# EAGLE design biggity (EAGLE 9.1.1)
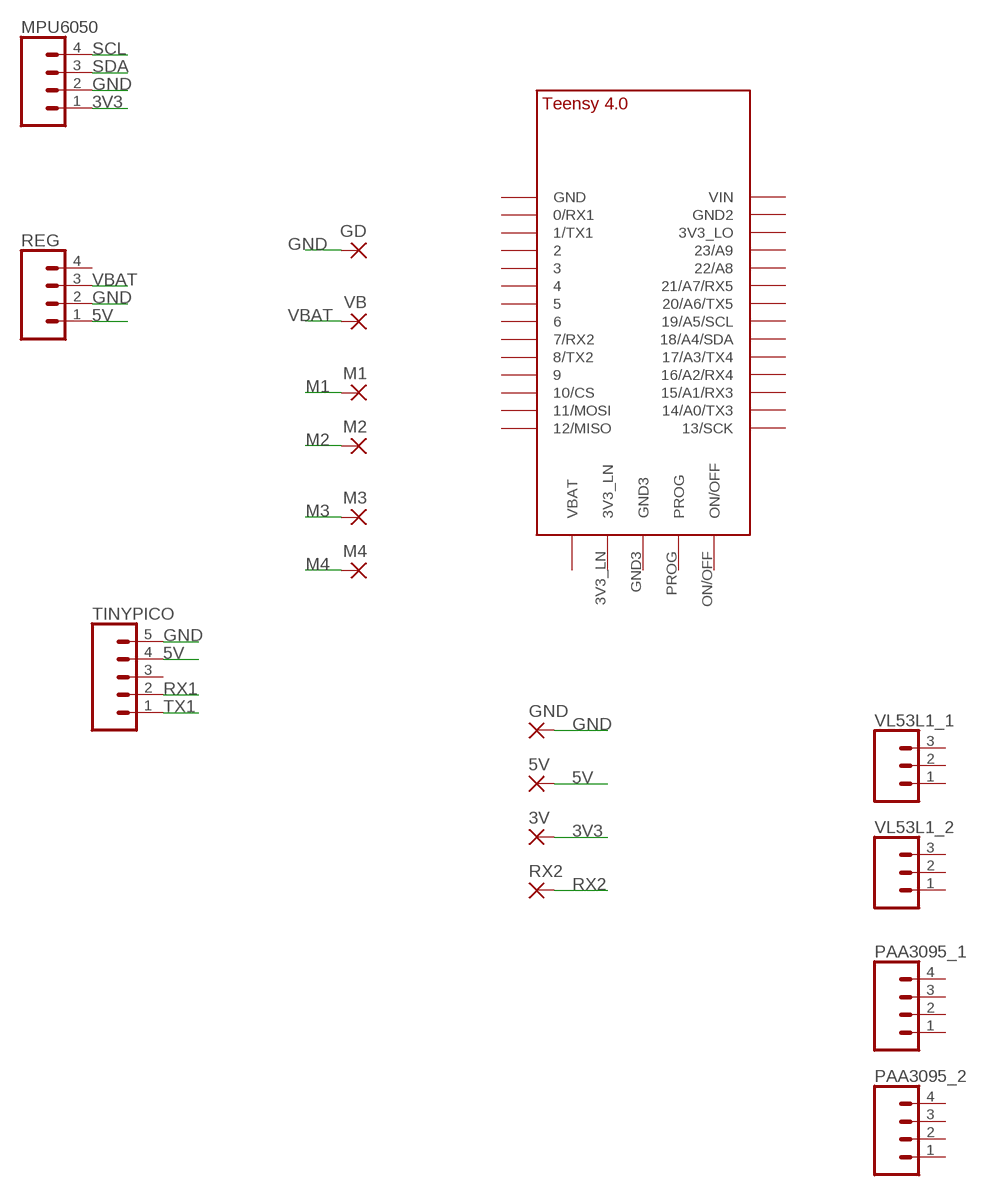
[diagram p0: schematic, sheet 1]

## Parts
3V  SMD2  [SMD1,27-2,54]
5V  SMD2  [SMD1,27-2,54]
GD  SMD2  [SMD1,27-2,54]
GND  SMD2  [SMD1,27-2,54]
M1  SMD2  [SMD1,27-2,54]
M2  SMD2  [SMD1,27-2,54]
M3  SMD2  [SMD1,27-2,54]
M4  SMD2  [SMD1,27-2,54]
MPU6050  CONN_041X04_NO_SILK  [1X04_NO_SILK]
PAA3095_1  CONN_041X04_NO_SILK  [1X04_NO_SILK]
PAA3095_2  CONN_041X04_NO_SILK  [1X04_NO_SILK]
REG  CONN_041X04_NO_SILK  [1X04_NO_SILK]
RX2  SMD2  [SMD1,27-2,54]
TINYPICO  CONN_05NO_SILK  [1X05_NO_SILK]
U$1  TEENSY_4.0  [TEENSY_4.0]
VB  SMD2  [SMD1,27-2,54]
VL53L1_1  CONN_031X03_NO_SILK  [1X03_NO_SILK]
VL53L1_2  CONN_031X03_NO_SILK  [1X03_NO_SILK]

## Nets
3V3: 3V.1(P) MPU6050.1
5V: 5V.1(P) REG.1 TINYPICO.4
GND: GD.1(P) GND.1(P) MPU6050.2 REG.2 TINYPICO.5
M1: M1.1(P)
M2: M2.1(P)
M3: M3.1(P)
M4: M4.1(P)
RX1: TINYPICO.2
RX2: RX2.1(P)
SCL: MPU6050.4
SDA: MPU6050.3
TX1: TINYPICO.1
VBAT: REG.3 VB.1(P)
Unconnected: PAA3095_1.1 PAA3095_1.2 PAA3095_1.3 PAA3095_1.4 PAA3095_2.1 PAA3095_2.2 PAA3095_2.3 PAA3095_2.4 REG.4 TINYPICO.3 U$1.0/RX(0/RX1) U$1.1/TX(1/TX1) U$1.2 U$1.3/CANTX U$1.3V3_LN U$1.3V3_LO U$1.4/CANRX U$1.5 U$1.6 U$1.7(7/RX2) U$1.8(8/TX2) U$1.9/CS U$1.10/CS U$1.11/MOSI U$1.12/MISO U$1.13/SCK U$1.14/A0(14/A0/TX3) U$1.15/A1(15/A1/RX3) U$1.16/A2(16/A2/RX4) U$1.17/A3(17/A3/TX4) U$1.18/A4/SDA U$1.19/A5/SCL U$1.20/A6(20/A6/TX5) U$1.21/A7(21/A7/RX5) U$1.22/A8 U$1.23/A9 U$1.GND U$1.GND2 U$1.GND3 U$1.ON/OFF U$1.PROG U$1.VBAT\(VBAT) U$1.VIN VL53L1_1.1 VL53L1_1.2 VL53L1_1.3 VL53L1_2.1 VL53L1_2.2 VL53L1_2.3

## Library data of the parts
3V 5V GD GND M1-M4 RX2 VB = wirepad:SMD2: SMD PAD
MPU6050 PAA3095_1 PAA3095_2 REG = SparkFun-Connectors:CONN_04: Multi connection point. Often used as Generic Header-pin footprint for 0.1 inch spaced/style header connections On any of the 0.1 inch spaced packages, you can populate with these: Break Away Headers - Straight <https://www.sparkfun.com/products/116> (PRT-00116) Break Away Male Headers - Right Angle <https://www.sparkfun.com/products/553> (PRT-00553) Female Headers <https://www.sparkfun.com/products/115> (PRT-00115) Break Away Headers - Machine Pin <https://www.sparkfun.com/products/117> (PRT-00117) Break Away Female Headers - Swiss Machine Pin <https://www.sparkfun.com/products/743> (PRT-00743) For SCREWTERMINALS and SPRING TERMINALS visit here: Screw Terimnals on SparkFun.com <https://www.sparkfun.com/search/results?term=Screw+Terminals> (5mm/3.5mm/2.54mm spacing) This device is also useful as a general connection point to wire up your design to another part of your project. Our various solder wires solder well into these plated through hole pads. Hook-Up Wire - Assortment (Stranded, 22 AWG) <https://www.sparkfun.com/products/11375> (PRT-11375) Hook-Up Wire - Assortment (Solid Core, 22 AWG) <https://www.sparkfun.com/products/11367> (PRT-11367) View the entire wire category on our website here <https://www.sparkfun.com/categories/141> Special notes: Molex polarized connector foot print use with SKU : PRT-08231 with associated crimp pins and housings. 1MM SMD Version SKU: PRT-10208; PROD_ID: CONN-09696
TINYPICO = SparkFun-Connectors:CONN_05: Multi connection point. Often used as Generic Header-pin footprint for 0.1 inch spaced/style header connections On any of the 0.1 inch spaced packages, you can populate with these: Break Away Headers - Straight <https://www.sparkfun.com/products/116> (PRT-00116) Break Away Male Headers - Right Angle <https://www.sparkfun.com/products/553> (PRT-00553) Female Headers <https://www.sparkfun.com/products/115> (PRT-00115) Break Away Headers - Machine Pin <https://www.sparkfun.com/products/117> (PRT-00117) Break Away Female Headers - Swiss Machine Pin <https://www.sparkfun.com/products/743> (PRT-00743) For SCREWTERMINALS and SPRING TERMINALS visit here: Screw Terimnals on SparkFun.com <https://www.sparkfun.com/search/results?term=Screw+Terminals> (5mm/3.5mm/2.54mm spacing) This device is also useful as a general connection point to wire up your design to another part of your project. Our various solder wires solder well into these plated through hole pads. Hook-Up Wire - Assortment (Stranded, 22 AWG) <https://www.sparkfun.com/products/11375> (PRT-11375) Hook-Up Wire - Assortment (Solid Core, 22 AWG) <https://www.sparkfun.com/products/11367> (PRT-11367) View the entire wire category on our website here <https://www.sparkfun.com/categories/141> Special notes: Molex polarized connector foot print use with SKU : PRT-08231 with associated crimp pins and housings. 1MM SMD Version SKU: PRT-10208
U$1 = TEENSY 4.0:TEENSY_4.0
VL53L1_1 VL53L1_2 = SparkFun-Connectors:CONN_03: Multi connection point. Often used as Generic Header-pin footprint for 0.1 inch spaced/style header connections On any of the 0.1 inch spaced packages, you can populate with these: Break Away Headers - Straight <https://www.sparkfun.com/products/116> (PRT-00116) Break Away Male Headers - Right Angle <https://www.sparkfun.com/products/553> (PRT-00553) Female Headers <https://www.sparkfun.com/products/115> (PRT-00115) Break Away Headers - Machine Pin <https://www.sparkfun.com/products/117> (PRT-00117) Break Away Female Headers - Swiss Machine Pin <https://www.sparkfun.com/products/743> (PRT-00743) Stackable Header - 3 Pin (Female, 0.1") <https://www.sparkfun.com/products/13875> (PRT-13875) For SCREWTERMINALS and SPRING TERMINALS visit here: Screw Terimnals on SparkFun.com <https://www.sparkfun.com/search/results?term=Screw+Terminals> (5mm/3.5mm/2.54mm spacing) This device is also useful as a general connection point to wire up your design to another part of your project. Our various solder wires solder well into these plated through hole pads. Hook-Up Wire - Assortment (Stranded, 22 AWG) <https://www.sparkfun.com/products/11375> (PRT-11375) Hook-Up Wire - Assortment (Solid Core, 22 AWG) <https://www.sparkfun.com/products/11367> (PRT-11367) View the entire wire category on our website here <https://www.sparkfun.com/categories/141> Special notes: Molex polarized connector foot print use with SKU : PRT-08232 with associated crimp pins and housings.

## Board
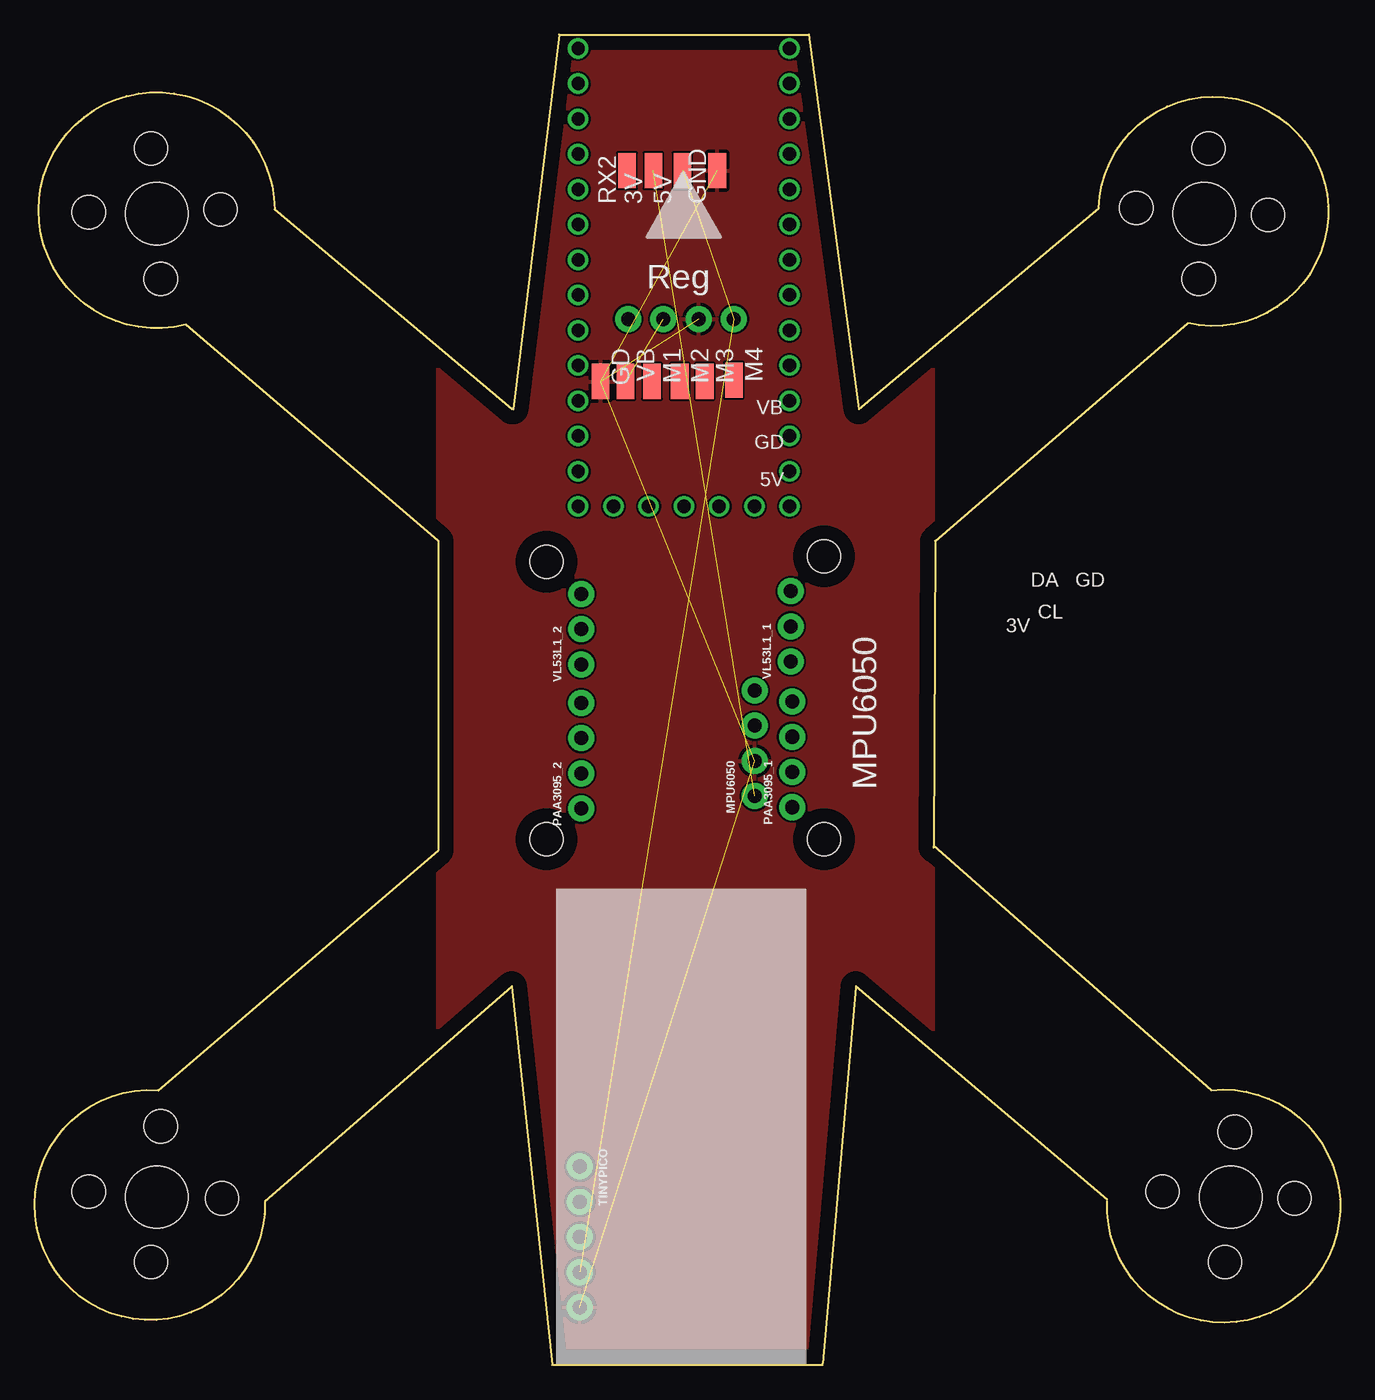
[diagram p1: board, top side]
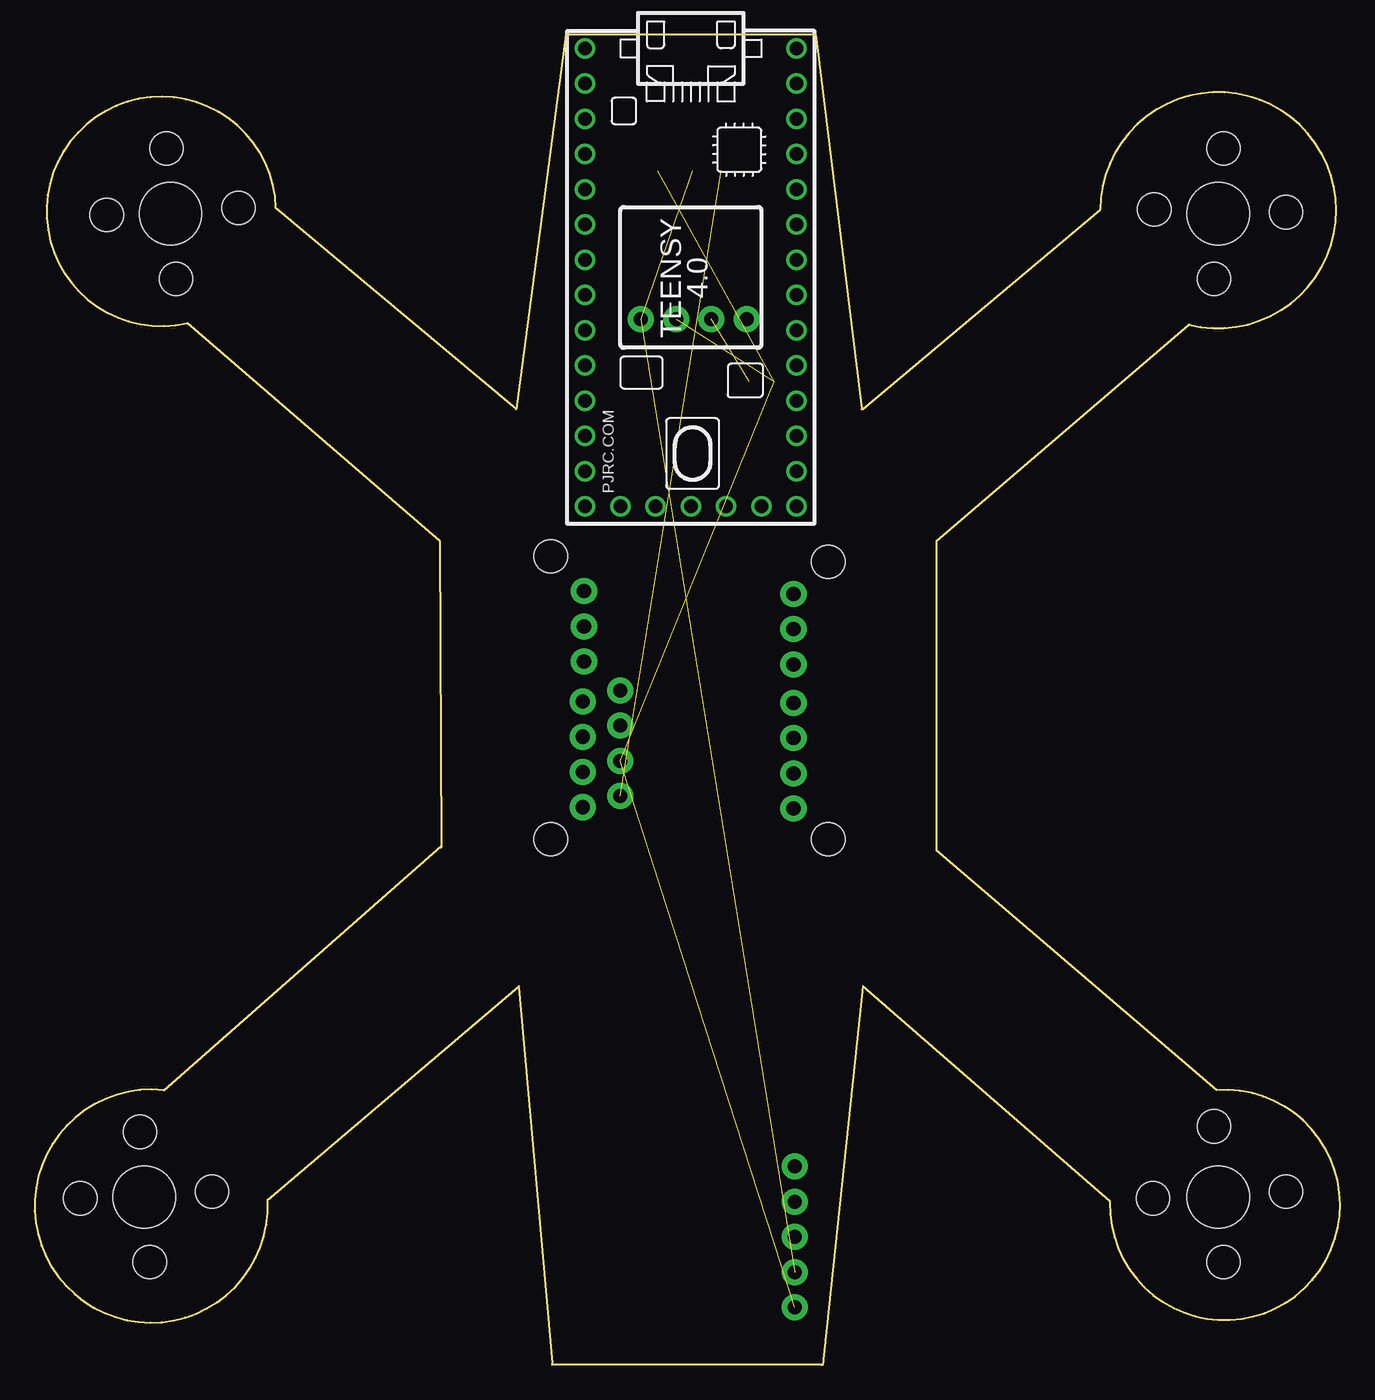
[diagram p2: board, bottom side, seen from below]

Size 94.08 x 95.9 mm. Coordinates in mm from the lower left corner, seen from the top.
Outline: 64.79,37.3 64.89,59.4 83.09,75.1 arc281 76.69,83.4 59.39,68.9 55.79,95.9 37.79,95.9 34.49,68.9
Outline: 37.39,0 56.79,0
Outline: 37.29,0 34.39,27.3 16.59,11.8
Outline: 59.19,27.2 56.79,0.1
Outline: 64.79,37.4 84.79,19.8 arc-279 77.29,11.8
Outline: 77.29,11.9 59.19,27.3
Outline: 34.39,68.9 17.29,83.3 arc284 10.89,75 29.09,59.4 29.09,37.1 8.89,19.8 arc275 16.59,11.7
Copper layers (1*16): Top 0.035mm / dielectric 1.5mm / Bottom 0.035mm
Design rules "default": minimum track width 6mil, minimum drill 0.35mm, track to track 6mil, track to pad 6mil, pad to pad 6mil, via to via 6mil, smd to smd 6mil, copper to edge 40mil, drill to drill 6mil, minimum pad ring 10mil, minimum via ring 8mil, stop-mask expansion 4mil, vias tented up to drill 0mil, thermal gap 10mil
Holes 2.4 mm at 36.89,37.9 56.89,58.3 36.89,57.9 56.89,37.9 84.59,87.7 83.89,78.3 79.39,83.4 88.89,82.9 8.39,87.7 9.09,78.3 3.89,83.1 13.39,83.3 86.49,16.8 85.79,7.4 81.29,12.5 90.79,12 9.09,17.2 8.39,7.4 3.89,12.5 13.49,12
Holes 4.5 mm at 84.29,83 8.79,83 86.19,12.1 8.79,12.1

### Footprints (pad centres in the part's own frame; a part is rotated, then mirrored left to right if it is on the bottom)
SMD1,27-2,54 = smd 1.27 x 2.54: 1 0,0
1X04_NO_SILK = drill 1.016 pad 1.88: 1 0,0; 2 2.54,0; 3 5.08,0; 4 7.62,0
1X05_NO_SILK = drill 1.016 pad 1.88: 1 0,0; 2 2.54,0; 3 5.08,0; 4 7.62,0; 5 10.16,0
TEENSY_4.0 = drill 0.965: 0/RX -13.97,-7.62; 1/TX -11.43,-7.62; 2 -8.89,-7.62; 3/CANTX -6.35,-7.62; 3V3_LN 16.51,-2.54; 3V3_LO -11.43,7.62; 4/CANRX -3.81,-7.62; 5 -1.27,-7.62; 6 1.27,-7.62; 7 3.81,-7.62; 8 6.35,-7.62; 9/CS 8.89,-7.62; 10/CS 11.43,-7.62; 11/MOSI 13.97,-7.62; 12/MISO 16.51,-7.62; 13/SCK 16.51,7.62; 14/A0 13.97,7.62; 15/A1 11.43,7.62; 16/A2 8.89,7.62; 17/A3 6.35,7.62; 18/A4/SDA 3.81,7.62; 19/A5/SCL 1.27,7.62; 20/A6 -1.27,7.62; 21/A7 -3.81,7.62; 22/A8 -6.35,7.62; 23/A9 -8.89,7.62; GND -16.51,-7.62; GND2 -13.97,7.62; GND3 16.51,0; ON/OFF 16.51,5.08; PROG 16.51,2.54; VBAT\ 16.51,-5.08; VIN -16.51,7.62
1X03_NO_SILK = drill 1.016 pad 1.88: 1 0,0; 2 2.54,0; 3 5.08,0

### Placement (x,y rotation side)
3V  44.59,86.1 0 top
5V  46.69,86.1 0 top
GD  40.79,70.9 180 top
GND  49.19,86.1 0 top
M1  44.49,70.9 180 top
M2  46.49,70.9 180 top
M3  48.29,70.9 180 top
M4  50.39,71 180 top
MPU6050  51.89,41 90 top
PAA3095_1  54.59,40.2 90 top
PAA3095_2  39.39,40.1 90 top
REG  50.39,75.4 180 top
RX2  42.69,86.1 0 top
TINYPICO  39.29,14.3 270 top
U$1  46.79,78.4 270 bottom
VB  42.59,70.9 180 top
VL53L1_1  54.49,50.7 90 top
VL53L1_2  39.39,50.5 90 top

### Tracks (layer width: path | path; a pad name or v marks a point on that pad's centre or on a via)
3V3  (1 unrouted)
5V  (2 unrouted)
GND  (4 unrouted)
  pour Top: 64.74,95.56 64.74,-0.45 29.09,-0.45 29.09,95.56
VBAT  (1 unrouted)

### Text on the board
tNames: Reg | VB | GD | 5V | DA | GD | CL | 3V | MPU6050 | SK | CS | 5V | GD | SI | 3V | SO | CL | DA